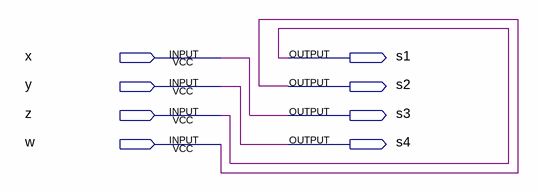
[diagram p0: schematic sheet]
// Quartus schematic rotate2.bdf as structural Verilog: 0 symbols, 8 pins
module rotate2 (
  input  x,
  input  y,
  input  z,
  input  w,
  output s1,
  output s2,
  output s3,
  output s4
);


  assign s1 = z;
  assign s2 = w;
  assign s3 = x;
  assign s4 = y;
endmodule
